# Altium schematic sheet Microcontroller.SchDoc
size B; SheetNumber: 3; SheetTotal: 7
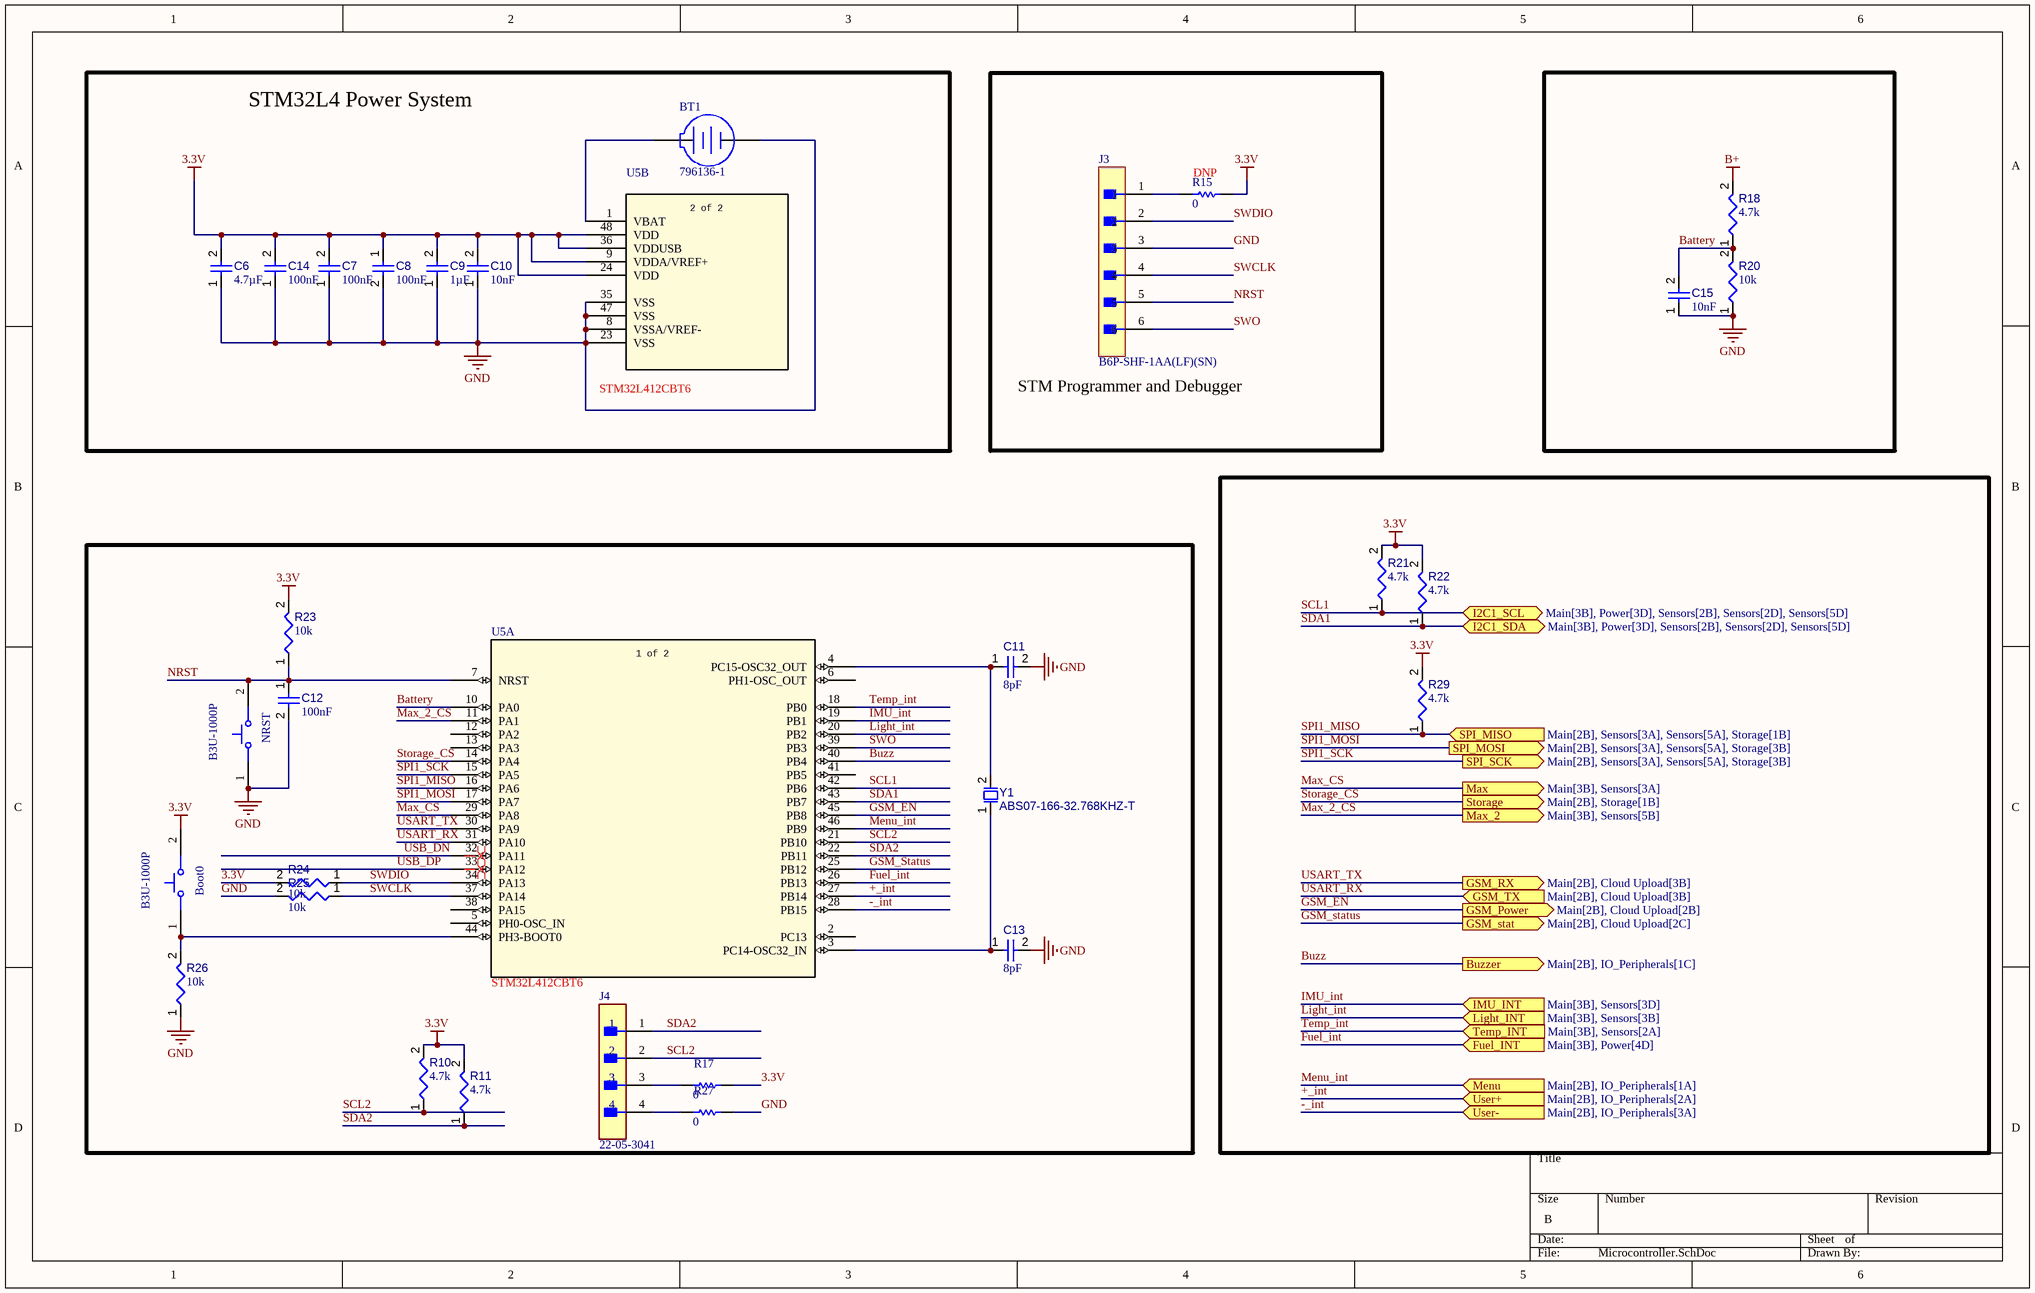
[diagram p0: Microcontroller.SchDoc]

## Parts
Boot0  B3U-1000P  [OMRON-B3U-1000_V]
BT1  796136-1  [TECO-796136-1_V]
C6  value 4.7µF  [CAPC0603(1608)100_L]  (hidden comment: Capacitor 4.7µF +/-20% 10V 0603)
C7  value 100nF  [FP-GCJ188-0_2-IPC_C]  (hidden comment: GCJ188R71C104KA01D)
C8  value 100nF  [FP-GCJ188-0_2-IPC_C]  (hidden comment: GCJ188R71C104KA01D)
C9  value 1µF  [CAPC1608X90X35ML15T15]  (hidden comment: Capacitor 1uF +/- 10% 16V 0603)
C10  value 10nF  [CAPC1608X95X40ML15T15]  (hidden comment: VJ0603Y103KXQCW1BC)
C11  value 8pF  [FP-GCM188-0_1-IPC_B]  (hidden comment: GCM1885C2A8R0DA16D)
C12  value 100nF  [FP-GCJ188-0_2-IPC_C]  (hidden comment: GCJ188R71C104KA01D)
C13  value 8pF  [FP-GCM188-0_1-IPC_B]  (hidden comment: GCM1885C2A8R0DA16D)
C14  value 100nF  [FP-GCJ188-0_2-IPC_C]  (hidden comment: GCJ188R71C104KA01D)
C15  value 10nF  [CAPC1608X95X40ML15T15]  (hidden comment: VJ0603Y103KXQCW1BC)
J3  B6P-SHF-1AA(LF)(SN)  [FP-B6P-SHF-1AA_LF_SN-MFG]
J4  22-05-3041  [FP-22-05-3041-MFG]
NRST  B3U-1000P  [OMRON-B3U-1000_V]
R10  value 4.7k  [RESC1608X55X25ML10T15]  (hidden comment: Resistor 4k7 +/-1% 0603 100 mW)
R11  value 4.7k  [RESC1608X55X25ML10T15]  (hidden comment: Resistor 4k7 +/-1% 0603 100 mW)
R15  value 0  [RESC3116X70X50ML13T20]  (hidden comment: Resistor 0R +/- 0.05% 1206 250 mW)
R17  value 0  [RESC1608X55X25ML10T15]  (hidden comment: Resistor 0R +/- 5% 0603 100 mW)
R18  value 4.7k  [RESC1608X55X25ML10T15]  (hidden comment: Resistor 4k7 +/-1% 0603 100 mW)
R20  value 10k  [RESC2013X50X35ML15T15]  (hidden comment: Resistor 10k +/-1% 0805 125 mW)
R21  value 4.7k  [RESC1608X55X25ML10T15]  (hidden comment: Resistor 4k7 +/-1% 0603 100 mW)
R22  value 4.7k  [RESC1608X55X25ML10T15]  (hidden comment: Resistor 4k7 +/-1% 0603 100 mW)
R23  value 10k  [RESC2013X50X35ML15T15]  (hidden comment: Resistor 10k +/-1% 0805 125 mW)
R24  value 10k  [RESC2013X50X35ML15T15]  (hidden comment: Resistor 10k +/-1% 0805 125 mW)
R25  value 10k  [RESC2013X50X35ML15T15]  (hidden comment: Resistor 10k +/-1% 0805 125 mW)
R26  value 10k  [RESC2013X50X35ML15T15]  (hidden comment: Resistor 10k +/-1% 0805 125 mW)
R27  value 0  [RESC1608X55X25ML10T15]  (hidden comment: Resistor 0R +/- 5% 0603 100 mW)
R29  value 4.7k  [RESC1608X55X25ML10T15]  (hidden comment: Resistor 4k7 +/-1% 0603 100 mW)
U5  STM32L412CBT6  [LQFP-48]  (parts A,B of 2)
Y1  ABS07-166-32.768KHZ-T  [EPSON-FC-135_V]

## Blocks framed on the sheet
STM32L4 Power System: BT1 C6-C10 C14 U5
STM Programmer and Debugger: J3 R15

## Ports
Buzzer (out, see Main[2B], IO_Peripherals[1C]), Fuel_INT (in, see Main[3B], Power[4D]), GSM_Power (out, see Main[2B], Cloud Upload[2B]), GSM_RX (out, see Main[2B], Cloud Upload[3B]), GSM_stat (out, see Main[2B], Cloud Upload[2C]), GSM_TX (in, see Main[2B], Cloud Upload[3B]), I2C1_SCL (bidir, see Main[3B], Power[3D], Sensors[2B], Sensors[2D], Sensors[5D]), I2C1_SDA (bidir, see Main[3B], Power[3D], Sensors[2B], Sensors[2D], Sensors[5D]), IMU_INT (in, see Main[3B], Sensors[3D]), Light_INT (in, see Main[3B], Sensors[3B]), Max (out, see Main[3B], Sensors[3A]), Max_2 (out, see Main[3B], Sensors[5B]), Menu (in, see Main[2B], IO_Peripherals[1A]), SPI_MISO (in, see Main[2B], Sensors[3A], Sensors[5A], Storage[1B]), SPI_MOSI (out, see Main[2B], Sensors[3A], Sensors[5A], Storage[3B]), SPI_SCK (out, see Main[2B], Sensors[3A], Sensors[5A], Storage[3B]), Storage (out, see Main[2B], Storage[1B]), Temp_INT (in, see Main[3B], Sensors[2A]), User+ (in, see Main[2B], IO_Peripherals[2A]), User- (in, see Main[2B], IO_Peripherals[3A])

## Nets
3.3V: Boot0.2 C6.2 C7.2 C8.1 C9.2 C10.2 C14.2 R10.2 R11.2 R15.2 R17.2 R21.2 R22.2 R23.2 R24.2 R29.2 U5.9(VDDA/VREF+) U5.24(VDD) U5.36(VDDUSB) U5.48(VDD)
B+: R18.2
GND: BT1.2(-) C6.1 C7.1 C8.2 C9.1 C10.1 C11.2 C12.2 C13.2 C14.1 C15.1 J3.3 NRST.1 R20.1 R25.2 R26.1 R27.2 U5.8(VSSA/VREF-) U5.23(VSS) U5.35(VSS) U5.47(VSS)
+_int: U5.27(PB14) ; port User+
-_int: U5.28(PB15) ; port User-
Battery: C15.2 R18.1 R20.2 U5.10(PA0)
Buzz: U5.40(PB4) ; port Buzzer
Fuel_int: U5.26(PB13) ; port Fuel_INT
GSM_EN: U5.45(PB8) ; port GSM_Power
GSM_Status: U5.25(PB12) ; port GSM_stat
IMU_int: U5.19(PB1) ; port IMU_INT
Light_int: U5.20(PB2) ; port Light_INT
Max_2_CS: U5.11(PA1) ; port Max_2
Max_CS: U5.29(PA8) ; port Max
Menu_int: U5.46(PB9) ; port Menu
NRST: C12.1 J3.5 NRST.2 R23.1 U5.7(NRST)
SCL1: R21.1 U5.42(PB6) ; port I2C1_SCL
SCL2: J4.2 R10.1 U5.21(PB10)
SDA1: R22.1 U5.43(PB7) ; port I2C1_SDA
SDA2: J4.1 R11.1 U5.22(PB11)
SPI1_MISO: R29.1 U5.16(PA6) ; port SPI_MISO
SPI1_MOSI: U5.17(PA7) ; port SPI_MOSI
SPI1_SCK: U5.15(PA5) ; port SPI_SCK
Storage_CS: U5.14(PA4) ; port Storage
SWCLK: J3.4 R25.1 U5.37(PA14)
SWDIO: J3.2 R24.1 U5.34(PA13)
SWO: J3.6 U5.39(PB3)
Temp_int: U5.18(PB0) ; port Temp_INT
USART_RX: U5.31(PA10) ; port GSM_TX
USART_TX: U5.30(PA9) ; port GSM_RX
USB_DN: U5.32(PA11)
USB_DP: U5.33(PA12)
NetBoot0_1: Boot0.1 R26.2 U5.44(PH3-BOOT0)
NetBT1_1: BT1.1(+) U5.1(VBAT)
NetC11_1: C11.1 U5.4(PC15-OSC32_OUT) Y1.2
NetC13_1: C13.1 U5.3(PC14-OSC32_IN) Y1.1
NetJ3_1: J3.1 R15.1
NetJ4_3: J4.3 R17.1
NetJ4_4: J4.4 R27.1

Not connected (* = marked no-connect by the designer): U5 2(PC13) 5(PH0-OSC_IN) 6(PH1-OSC_OUT) 12(PA2) 13(PA3) 38(PA15) 41(PB5)

## Layout directives
differential pair; net class USB_DN; differential pair class USB_DN: (no net found under the mark)
differential pair; net class USB_DP; differential pair class USB_DP: (no net found under the mark)

## Notes on the sheet
- (near R15) DNP
- (in symbol STM32L412CBT6, part A) 1 of 2
- (in symbol STM32L412CBT6, part B) 2 of 2

## Library data of the parts
Boot0 NRST = CMP-011-00000-2: Tactile Switch, SPST-NO, 0.05 A, 12 V, -25 to 70 degC, 2-Pin SMD, RoHS, Tape and Reel; Manufacturer: Omron Electronic Components; IP Rating: IP40; Current Rating: 50mA; Max Contact Resistance: 100mohm; Operating Force: 153gf; Throw Configuration: SPST; Resistance: 0.1Ohm; Max Voltage Rating (DC): 12V; Contact Material: Silver; Max Current Rating: 50mA; Datasheet URL: http://www.omron.com/ecb/products/pdf/en-b3u.pdf; Mounting Technology: SM; Case/Package: B3U-1000; Packaging: TapeandReel; Package Reference: B3U-1000; Manufacturer URL: http://www.omron.com/; Datasheet Version: Jan-15; RoHS Compliant: True; Max Operating Temperature: 70°C; Contact Current Rating: 50mA; Package Quantity: 3500; Package Description: 2-Pin Surface Mount Device, Body 3 x 2.5 mm; Voltage Rating (DC): 12V; Min Operating Temperature: -25°C; Voltage Rating: 12V
BT1 = CMP-002-00002-2: Battery Connector, 1 Cell, CR2032, 2-Pin SMD, RoHS, Tape and Reel; Manufacturer: TE Connectivity; Max Voltage Rating (AC): 30V; Connector Type: BatteryHolder; Batteries: 1; Datasheet URL: http://www.te.com/commerce/DocumentDelivery/DDEController?Action=srchrtrv&DocNm=796136&DocType=Customer+Drawing&DocLang=English&DocFormat=pdf&PartCntxt=796136-1; Contact Plating: Tin; Case/Package: 796136-1; Colour: Black; Package Reference: 796136-1; Package Quantity: 400; Pins: 2; Mounting Technology: SM; RoHS Compliant: True; Datasheet Version: Dec-13; Package Description: 2-Pin Surface Mount Device, Body 32.31 x 19.05 mm; Packaging: TapeandReel; Manufacturer URL: http://www.te.com/; Contact Material: Bronze
C6 = CMP-001-00076-4: Chip Capacitor, 4.7µF +/-20%, 10V, 0603, Thickness 1 mm; Tolerance: 10%; Mounting Technology: SMT; Case/Package: 0603; Pins: 2; Min Operating Temperature: -55°C; Max Operating Temperature: 85°C; Voltage Rating: 10V
C7 C8 C12 C14 = CMP-001-00083-1: 16V 100nF X7R ±10% 0603 Multilayer Ceramic Capacitors MLCC - SMD/SMT ROHS; Max Operating Temperature: 125°C; Mounting Technology: Surface Mount; Tolerance: 10%; Min Operating Temperature: -55°C; Case/Package: 0603; Voltage Rating: 16V
C9 = CMP-001-00004-6: Chip Capacitor, 1 uF, +/- 10%, 16 V, 0603 (1608 Metric); Capacitor Type: Ceramic; Mounting Technology: SM; RoHS Compliant: True; Min Operating Temperature: -55°C; Case/Package: 0603; Pins: 2; Voltage Rating: 16V; Max Operating Temperature: 125°C; Tolerance: 10%
C10 C15 = CMP-001-00085-1: Ceramic Capacitor, Multilayer, Ceramic, 10V, 10% +Tol, 10% -Tol, X7R, 15% TC, 0.01uF, Surface Mount, 0603; Min Operating Temperature: -55°C; Max Operating Temperature: 125°C; Tolerance: 10%; Mounting Technology: Surface Mount; Case/Package: 0603
C11 C13 = CMP-001-00087-1: 100V 8pF C0G 0603 Multilayer Ceramic Capacitors MLCC - SMD/SMT ROHS; Case/Package: 0603; Max Operating Temperature: 125°C; Voltage Rating: 100V; Min Operating Temperature: -55°C; Mounting Technology: Surface Mount
J3 = CMP-002-00077-1: Connector Header, NH Series, 6 Position, Top Entry, 2.5mm, 250V, 30-22 AWG, Natural; Gender: Male; Connector Type: Male Pin; Max Operating Temperature: 85°C; Mounting Technology: Through Hole; Min Operating Temperature: -25°C; Voltage Rating: 250V
J4 = CMP-002-00081-1: KK 254 Solid Header, Right-Angle, with Friction Lock, 4 Circuits, Tin (Sn) Plating; Gender: Male; Max Current Rating: 4A; Voltage Rating: 500V; Max Operating Temperature: 80°C; Min Operating Temperature: -40°C; Mounting Technology: Through Hole; Pins: 4
R10 R11 R18 R21 R22 R29 = CMP-009-00031-5: Chip Resistor, 4.7 KOhm, +/- 1%, 0.1 W, -55 to 155 degC, 0603 (1608 Metric); Power: 100mW; Tolerance: 1%; Mounting Technology: SM; Case/Package: 0603; RoHS Compliant: True; Pins: 2; Min Operating Temperature: -55°C; Max Operating Temperature: 155°C
R15 = CMP-009-00008-5: Chip Resistor, 0 Ohm, 0.25 W, -55 to 155 degC, 1206 (3216 Metric); Voltage Rating: 200V; Power: 250mW; Pins: 2; Min Operating Temperature: -55°C; Tolerance: 0.05%; RoHS Compliant: True; Max Operating Temperature: 155°C; Mounting Technology: SM; Case/Package: 1206
R17 R27 = CMP-009-00006-5: Chip Resistor, 0 Ohm, 0.1 W, -55 to 155 degC, 0603 (1608 Metric); Power: 100mW; Voltage Rating: 50V; Max Operating Temperature: 155°C; RoHS Compliant: True; Mounting Technology: SM; Case/Package: 0603; Min Operating Temperature: -55°C; Tolerance: 5%; Pins: 2
R20 R23-R26 = CMP-009-00018-5: Chip Resistor, 10 KOhm, +/- 1%, 125 mW, -55 to 155 degC, 0805 (2012 Metric); Power: 125mW; Voltage Rating: 150V; Tolerance: 1%; Pins: 2; Min Operating Temperature: -55°C; Case/Package: 0805; Max Operating Temperature: 155°C; RoHS Compliant: True; Mounting Technology: SM
U5 = STM32L412CBT6: Ultra-low-power with FPU Arm Cortex-M4 MCU 80 MHz with 128 Kbytes of Flash memory, USB; Manufacturer_Name: STMicroelectronics; Copyright: Copyright (C) 2026 Ultra Librarian. All rights reserved.; Manufacturer_Part_Number: STM32L412CBT6; RefDes: RefDes; Type: Type; Manufacturer Part Number 1: STM32L412CBT6
Y1 = CMP-003-00029-1: Crystal 32.768kHz 10ppm 7pF -40C +85C; Pins: 2; Frequency: 32.768kHz